# EAGLE schematic dwm1000v3 (EAGLE 8.3.2)
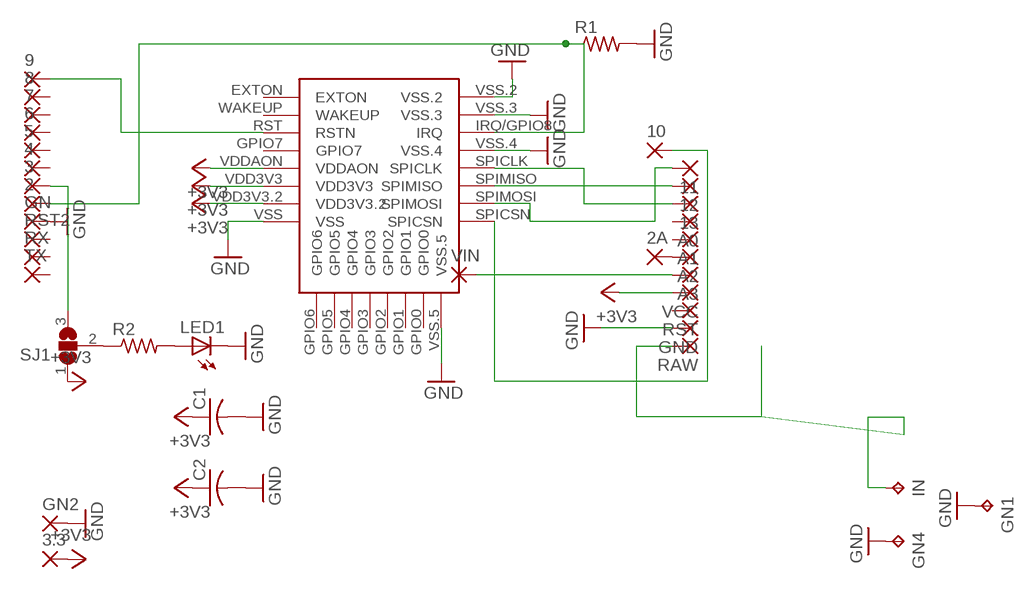
[diagram p0: schematic, sheet 1]

## Parts
2  SMD2  [SMD1,27-2,54]
2A  SMD2  [SMD1,27-2,54]
3  SMD2  [SMD1,27-2,54]
3.3  SMD2  [SMD1,27-2,54]
4  SMD2  [SMD1,27-2,54]
5  SMD2  [SMD1,27-2,54]
6  SMD2  [SMD1,27-2,54]
7  SMD2  [SMD1,27-2,54]
8  SMD2  [SMD1,27-2,54]
9  SMD2  [SMD1,27-2,54]
10  SMD2  [SMD1,27-2,54]
11  SMD2  [SMD1,27-2,54]
12  SMD2  [SMD1,27-2,54]
13  SMD2  [SMD1,27-2,54]
A0  SMD2  [SMD1,27-2,54]
A1  SMD2  [SMD1,27-2,54]
A2  SMD2  [SMD1,27-2,54]
A3  SMD2  [SMD1,27-2,54]
C1  C-USC0805  [C0805]
C2  C-USC0805  [C0805]
GN  SMD2  [SMD1,27-2,54]
GN1  TPTP13SQ  [TP13SQ]
GN2  SMD2  [SMD1,27-2,54]
GN4  TPTP13SQ  [TP13SQ]
GND  SMD2  [SMD1,27-2,54]
IN  TPTP13SQ  [TP13SQ]
LED1  LEDCHIPLED_0805  [CHIPLED_0805]
R1  R-US_R0603  [R0603]
R2  R-US_M0805  [M0805]
RAW  SMD2  [SMD1,27-2,54]
RST  SMD2  [SMD1,27-2,54]
RST2  SMD2  [SMD1,27-2,54]
RX  SMD2  [SMD1,27-2,54]
SJ1  SJ2W  [SJ_2]
TX  SMD2  [SMD1,27-2,54]
U$1  DWM1000  [DWM1000]
VCC  SMD2  [SMD1,27-2,54]
VIN  SMD2  [SMD1,27-2,54]

## Nets
+3V3: 3.3.1(P) C1.1 C2.1 SJ1.1 U$1.VDD3V3 U$1.VDD3V3.2 U$1.VDDAON VCC.1(P)
GND: C1.2 C2.2 GN1.TP GN2.1(P) GN4.TP GN.1(P) GND.1(P) LED1.C R1.2 U$1.VSS U$1.VSS.2 U$1.VSS.3 U$1.VSS.4 U$1.VSS.5
N$1: 10.1(P) U$1.SPICSN
N$2: 9.1(P) U$1.RST(RSTN)
N$3: 12.1(P) U$1.SPIMISO
N$4: 11.1(P) U$1.SPIMOSI
N$5: 13.1(P) U$1.SPICLK
N$6: 2.1(P) R1.1 U$1.IRQ/GPIO8(IRQ)
N$7: LED1.A R2.2
N$8: R2.1 SJ1.2
N$9: 3.1(P) SJ1.3
N$10: IN.TP RAW.1(P)
N$11: A3.1(P) VIN.1(P)
N$13: 2A.1(P) A2.1(P)
Unconnected: 4.1(P) 5.1(P) 6.1(P) 7.1(P) 8.1(P) A0.1(P) A1.1(P) RST2.1(P) RST.1(P) RX.1(P) TX.1(P) U$1.EXTON U$1.GPIO0 U$1.GPIO1 U$1.GPIO2 U$1.GPIO3 U$1.GPIO4 U$1.GPIO5 U$1.GPIO6 U$1.GPIO7 U$1.WAKEUP

## Library data of the parts
2 2A 3 3.3 4-13 A0 A1-A3 GN GN2 GND RAW RST RST2 RX TX VCC VIN = wirepad:SMD2: SMD PAD
C1 C2 = adafruit:C-US: CAPACITOR, American symbol
GN1 GN4 IN = testpad:TP: Test pad
LED1 = adafruit:LED: LED OSRAM: - CHIPLED LG R971, LG N971, LY N971, LG Q971, LY Q971, LO R971, LY R971 LH N974, LH R974 LS Q976, LO Q976, LY Q976 LO Q996 - Hyper CHIPLED LW Q18S LB Q993, LB Q99A, LB R99A - SideLED LS A670, LO A670, LY A670, LG A670, LP A670 LB A673, LV A673, LT A673, LW A673 LH A674 LY A675 LS A676, LA A676, LO A676, LY A676, LW A676 LS A679, LY A679, LG A679 - Hyper Micro SIDELED® LS Y876, LA Y876, LO Y876, LY Y876 LT Y87S - SmartLED LW L88C, LW L88S LB L89C, LB L89S, LG L890 LS L89K, LO L89K, LY L89K LS L896, LA L896, LO L896, LY L896 - TOPLED LS T670, LO T670, LY T670, LG T670, LP T670 LSG T670, LSP T670, LSY T670, LOP T670, LYG T670 LG T671, LOG T671, LSG T671 LB T673, LV T673, LT T673, LW T673 LH T674 LS T676, LA T676, LO T676, LY T676, LB T676, LH T676, LSB T676, LW T676 LB T67C, LV T67C, LT T67C, LS T67K, LO T67K, LY T67K, LW E67C LS E67B, LA E67B, LO E67B, LY E67B, LB E67C, LV E67C, LT E67C LW T67C LS T679, LY T679, LG T679 LS T770, LO T770, LY T770, LG T770, LP T770 LB T773, LV T773, LT T773, LW T773 LH T774 LS E675, LA E675, LY E675, LS T675 LS T776, LA T776, LO T776, LY T776, LB T776 LHGB T686 LT T68C, LB T68C - Hyper Mini TOPLED® LB M676 - Mini TOPLED Santana® LG M470 LS M47K, LO M47K, LY M47K Source: http://www.osram.convergy.de/
R1 R2 = adafruit:R-US_: RESISTOR, American symbol
SJ1 = jumper:SJ2W: SMD solder JUMPER
U$1 = dwm1000:DWM1000